# Altium schematic sheet ADTPCB.SchDoc
size C
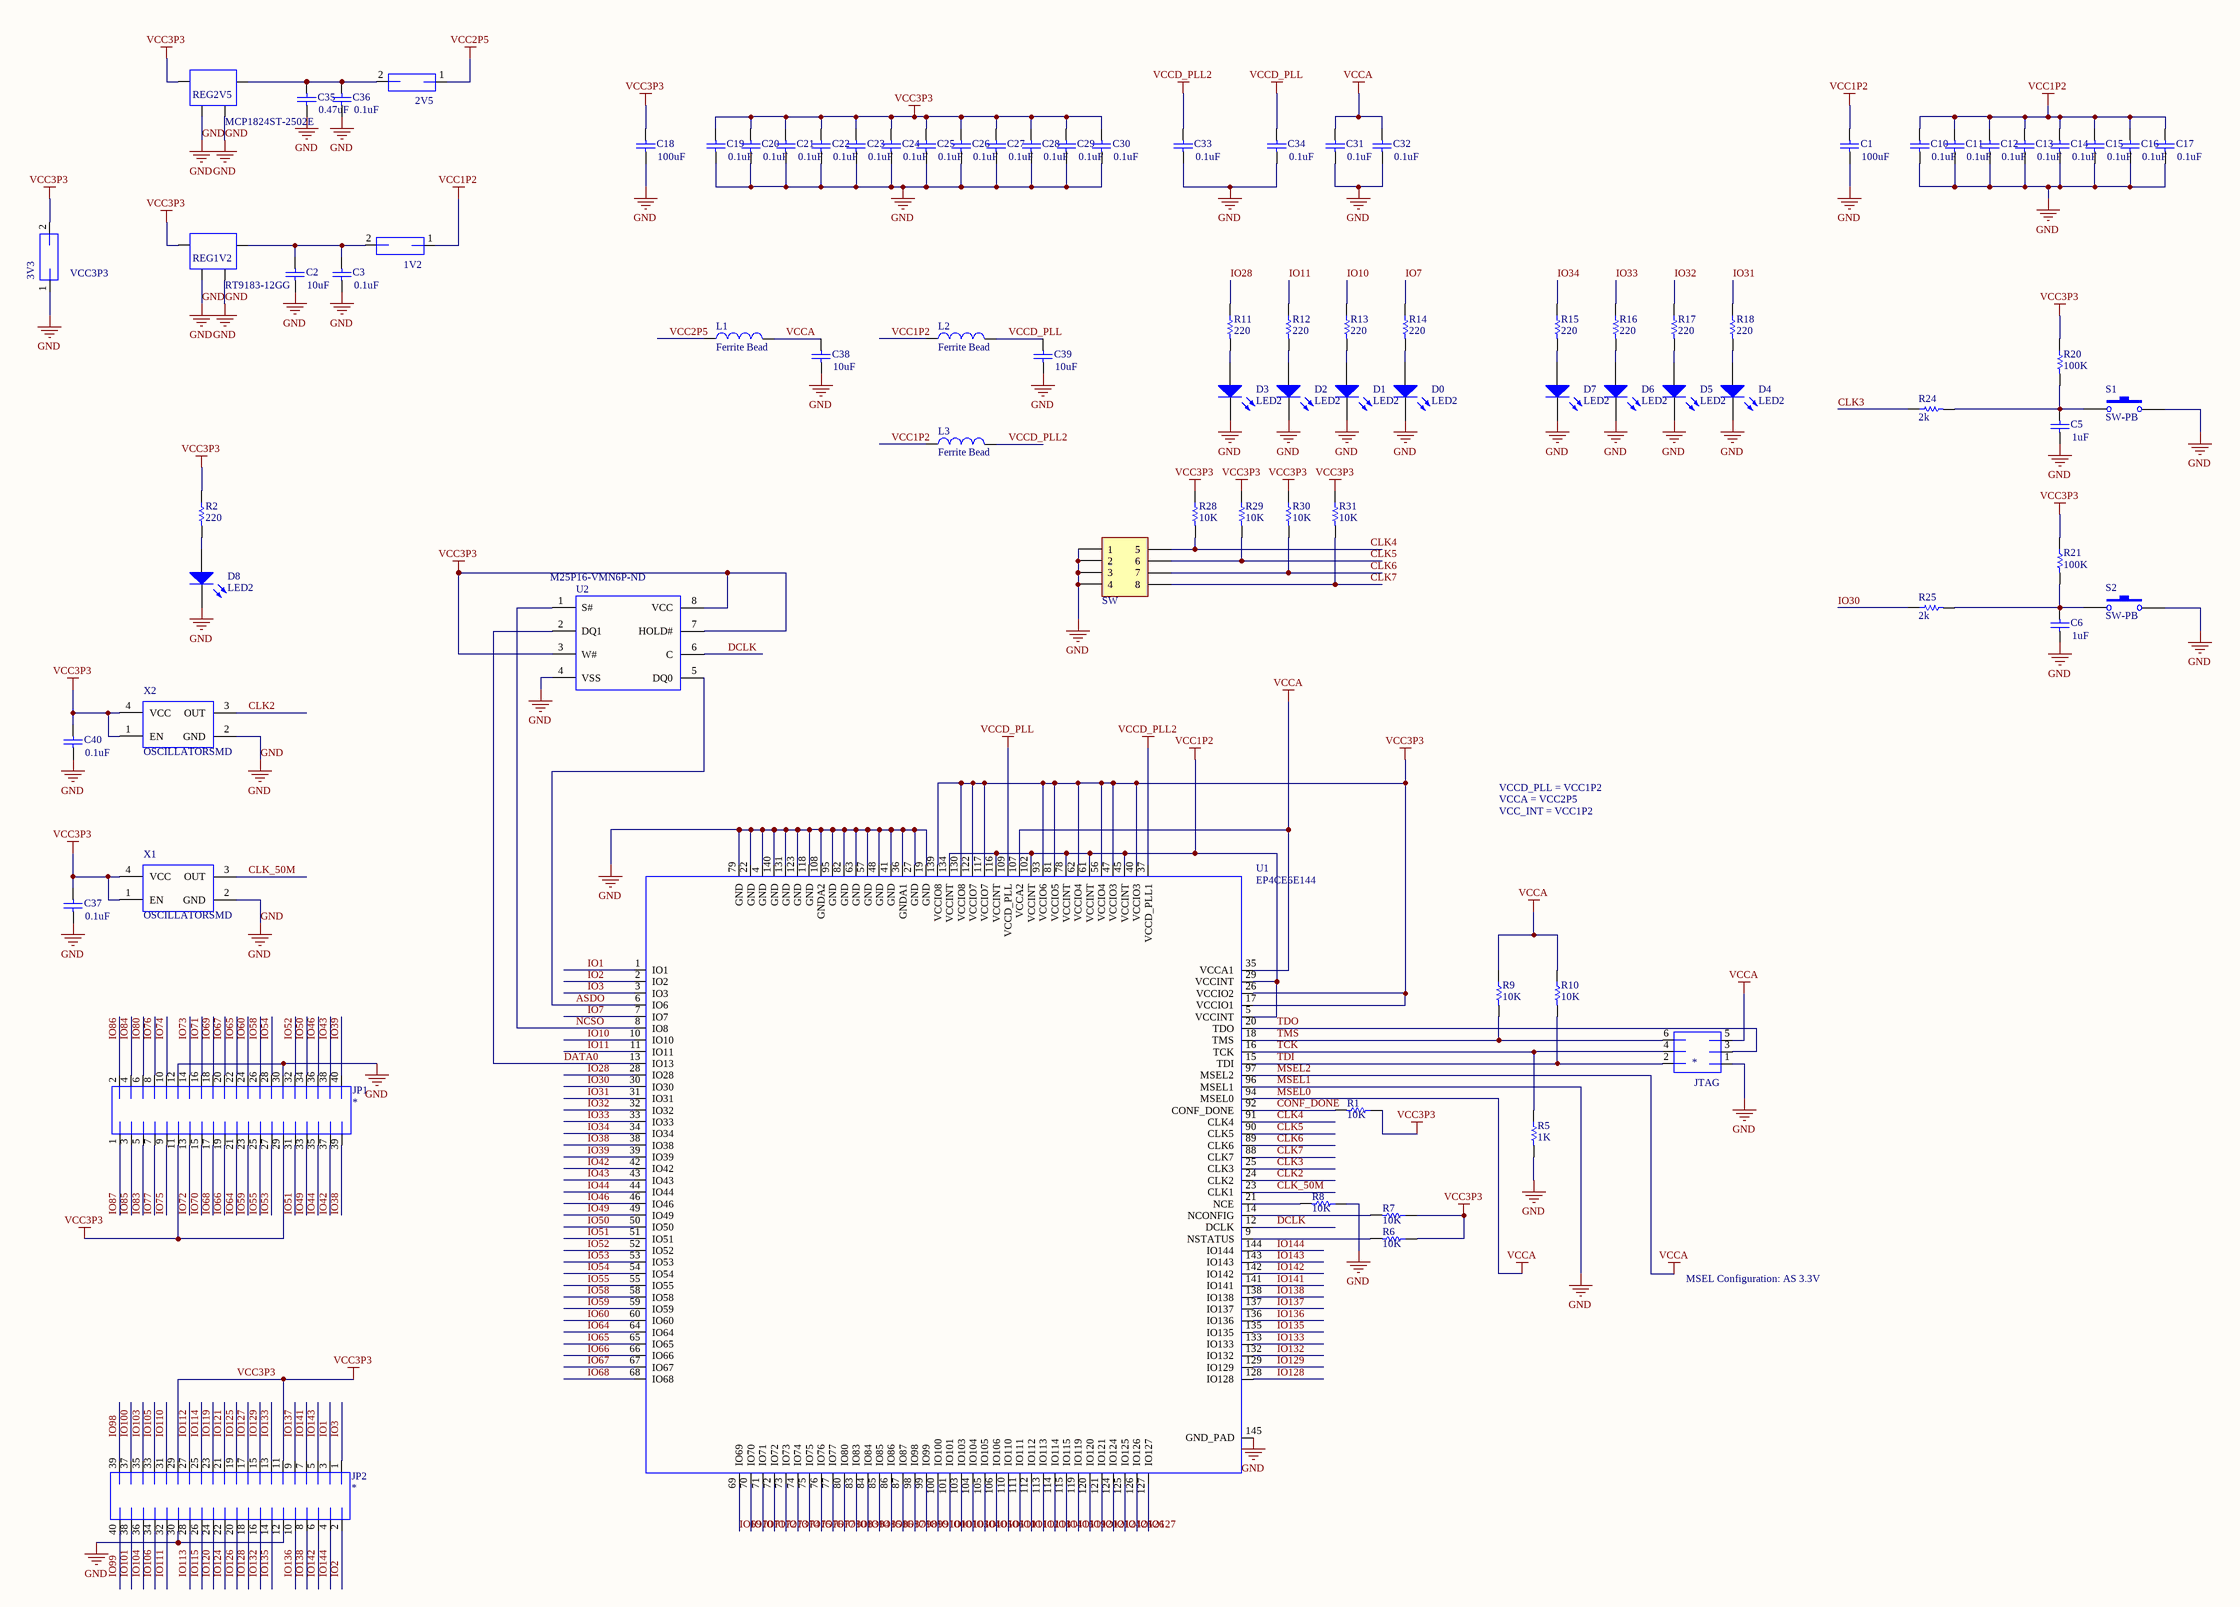
[diagram p0: ADTPCB.SchDoc]

## Parts
1V2  1V2  [HDR1X2]  (value not drawn)
2V5  2V5  [HDR1X2]  (value not drawn)
3V3  VCC3P3  [HDR1X2]
C1  value 100uF  [C1206]  (hidden comment: Cap)
C2  value 10uF  [C0805]  (hidden comment: Cap)
C3  value 0.1uF  [C0805]  (hidden comment: Cap)
C5  value 1uF  [C0805]  (hidden comment: Cap)
C6  value 1uF  [C0805]  (hidden comment: Cap)
C10  value 0.1uF  [C0805]  (hidden comment: Cap)
C11  value 0.1uF  [C0805]  (hidden comment: Cap)
C12  value 0.1uF  [C0805]  (hidden comment: Cap)
C13  value 0.1uF  [C0805]  (hidden comment: Cap)
C14  value 0.1uF  [C0805]  (hidden comment: Cap)
C15  value 0.1uF  [C0805]  (hidden comment: Cap)
C16  value 0.1uF  [C0805]  (hidden comment: Cap)
C17  value 0.1uF  [C0805]  (hidden comment: Cap)
C18  value 100uF  [C1206]  (hidden comment: Cap)
C19  value 0.1uF  [C0805]  (hidden comment: Cap)
C20  value 0.1uF  [C0805]  (hidden comment: Cap)
C21  value 0.1uF  [C0805]  (hidden comment: Cap)
C22  value 0.1uF  [C0805]  (hidden comment: Cap)
C23  value 0.1uF  [C0805]  (hidden comment: Cap)
C24  value 0.1uF  [C0805]  (hidden comment: Cap)
C25  value 0.1uF  [C0805]  (hidden comment: Cap)
C26  value 0.1uF  [C0805]  (hidden comment: Cap)
C27  value 0.1uF  [C0805]  (hidden comment: Cap)
C28  value 0.1uF  [C0805]  (hidden comment: Cap)
C29  value 0.1uF  [C0805]  (hidden comment: Cap)
C30  value 0.1uF  [C0805]  (hidden comment: Cap)
C31  value 0.1uF  [C0805]  (hidden comment: Cap)
C32  value 0.1uF  [C0805]  (hidden comment: Cap)
C33  value 0.1uF  [C0805]  (hidden comment: Cap)
C34  value 0.1uF  [C0805]  (hidden comment: Cap)
C35  value 0.47uF  [C0805]  (hidden comment: Cap)
C36  value 0.1uF  [C0805]  (hidden comment: Cap)
C37  value 0.1uF  [C0805]  (hidden comment: Cap)
C38  value 10uF  [C0805]  (hidden comment: Cap)
C39  value 10uF  [C0805]  (hidden comment: Cap)
C40  value 0.1uF  [C0805]  (hidden comment: Cap)
D0  LED2  [CD2012-0805]
D1  LED2  [CD2012-0805]
D2  LED2  [CD2012-0805]
D3  LED2  [CD2012-0805]
D4  LED2  [CD2012-0805]
D5  LED2  [CD2012-0805]
D6  LED2  [CD2012-0805]
D7  LED2  [CD2012-0805]
D8  LED2  [CD2012-0805]
JP1  *  [HDR2X20]
JP2  *  [HDR2X20]
JTAG  *  [HDR1X6]
L1  Ferrite Bead  [2029]
L2  Ferrite Bead  [2029]
L3  Ferrite Bead  [2029]
R1  value 10K  [6-0805_L]  (hidden comment: Res Semi)
R2  value 220  [6-0805_L]  (hidden comment: Res Semi)
R5  value 1K  [6-0805_L]  (hidden comment: Res Semi)
R6  value 10K  [6-0805_L]  (hidden comment: Res Semi)
R7  value 10K  [6-0805_L]  (hidden comment: Res Semi)
R8  value 10K  [6-0805_L]  (hidden comment: Res Semi)
R9  value 10K  [6-0805_L]  (hidden comment: Res Semi)
R10  value 10K  [6-0805_L]  (hidden comment: Res Semi)
R11  value 220  [6-0805_L]  (hidden comment: Res Semi)
R12  value 220  [6-0805_L]  (hidden comment: Res Semi)
R13  value 220  [6-0805_L]  (hidden comment: Res Semi)
R14  value 220  [6-0805_L]  (hidden comment: Res Semi)
R15  value 220  [6-0805_L]  (hidden comment: Res Semi)
R16  value 220  [6-0805_L]  (hidden comment: Res Semi)
R17  value 220  [6-0805_L]  (hidden comment: Res Semi)
R18  value 220  [6-0805_L]  (hidden comment: Res Semi)
R20  value 100K  [6-0805_L]  (hidden comment: Res Semi)
R21  value 100K  [6-0805_L]  (hidden comment: Res Semi)
R24  value 2k  [6-0805_L]  (hidden comment: Res Semi)
R25  value 2k  [6-0805_L]  (hidden comment: Res Semi)
R28  value 10K  [6-0805_L]  (hidden comment: Res Semi)
R29  value 10K  [6-0805_L]  (hidden comment: Res Semi)
R30  value 10K  [6-0805_L]  (hidden comment: Res Semi)
R31  value 10K  [6-0805_L]  (hidden comment: Res Semi)
REG1V2  RT9183-12GG  [SOT223_M]
REG2V5  MCP1824ST-2502E  [SOT223_M]
S1  SW-PB  [EVQ-P7C01K]
S2  SW-PB  [EVQ-P7C01K]
SW  DIP  [DIP]  (value not drawn)
U1  EP4CE6E144  [EQFP144_M]
U2  Supplier Part Number 1: M25P16-VMN6P-ND  [SO8_M]  (hidden comment: *)
X1  OSCILLATORSMD  [Oscillator SMD]
X2  OSCILLATORSMD  [Oscillator SMD]  (no BOM)

## Nets
GND: 3V3.1 C1.1 C2.1 C3.1 C5.1 C6.1 C10.1 C11.1 C12.1 C13.1 C14.1 C15.1 C16.1 C17.1 C18.1 C19.1 C20.1 C21.1 C22.1 C23.1 C24.1 C25.1 C26.1 C27.1 C28.1 C29.1 C30.1 C31.1 C32.1 C33.1 C34.1 C35.1 C36.1 C37.1 C38.1 C39.1 C40.1 D0.2(K) D1.2(K) D2.2(K) D3.2(K) D4.2(K) D5.2(K) D6.2(K) D7.2(K) D8.2(K) JP1.12 JP1.30 JP2.12 JP2.30 JTAG.1 R5.2 R8.1 REG1V2.2(GND) REG1V2.4(GND1) REG2V5.2(GND) REG2V5.4(GND1) S1.2 S2.2 SW.1 SW.2 SW.3 SW.4 U1.4(GND) U1.19(GND) U1.22(GND) U1.27(GND) U1.36(GNDA1) U1.41(GND) U1.48(GND) U1.57(GND) U1.63(GND) U1.79(GND) U1.82(GND) U1.95(GND) U1.96(MSEL1) U1.108(GNDA2) U1.118(GND) U1.123(GND) U1.131(GND) U1.140(GND) U1.145(GND_PAD) U2.4(VSS) X1.2(GND) X2.2(GND)  [also labelled MSEL1]
MSEL0: C31.2 C32.2 C38.2 JTAG.5 L1.2 R9.1 R10.1 U1.35(VCCA1) U1.94(MSEL0) U1.97(MSEL2) U1.107(VCCA2)  [also labelled MSEL2, VCCA]
VCC1P2: 1V2.1 C1.2 C10.2 C11.2 C12.2 C13.2 C14.2 C15.2 C16.2 C17.2 L2.1 L3.1 U1.5(VCCINT) U1.29(VCCINT) U1.45(VCCINT) U1.61(VCCINT) U1.78(VCCINT) U1.102(VCCINT) U1.116(VCCINT) U1.134(VCCINT)
VCC2P5: 2V5.1 L1.1
VCC3P3: 3V3.2 C18.2 C19.2 C20.2 C21.2 C22.2 C23.2 C24.2 C25.2 C26.2 C27.2 C28.2 C29.2 C30.2 C37.2 C40.2 JP1.11 JP1.29 JP2.11 JP2.29 R1.1 R2.1 R6.1 R7.1 R20.1 R21.1 R28.1 R29.1 R30.1 R31.1 REG1V2.1(IN) REG2V5.1(IN) U1.17(VCCIO1) U1.26(VCCIO2) U1.40(VCCIO3) U1.47(VCCIO3) U1.56(VCCIO4) U1.62(VCCIO4) U1.81(VCCIO5) U1.93(VCCIO6) U1.117(VCCIO7) U1.122(VCCIO7) U1.130(VCCIO8) U1.139(VCCIO8) U2.3(W#) U2.7(HOLD#) U2.8(VCC) X1.1(EN) X1.4(VCC) X2.1(EN) X2.4(VCC)
VCCD_PLL: C34.2 C39.2 L2.2 U1.109(VCCD_PLL)
VCCD_PLL2: C33.2 L3.2 U1.37(VCCD_PLL1)
ASDO: U1.6(IO6) U2.5(DQ0)
CLK2: U1.24(CLK2) X2.3(OUT)
CLK3: R24.1 U1.25(CLK3)
CLK4: R28.2 SW.5 U1.91(CLK4)
CLK5: R29.2 SW.6 U1.90(CLK5)
CLK6: R30.2 SW.7 U1.89(CLK6)
CLK7: R31.2 SW.8 U1.88(CLK7)
CLK_50M: U1.23(CLK1) X1.3(OUT)
CONF_DONE: R1.2 U1.92(CONF_DONE)
DATA0: U1.13(IO13) U2.2(DQ1)
DCLK: U1.12(DCLK) U2.6(C)
IO1: JP2.3 U1.1(IO1)
IO2: JP2.2 U1.2(IO2)
IO3: JP2.1 U1.3(IO3)
IO7: R14.1 U1.7(IO7)
IO10: R13.1 U1.10(IO10)
IO11: R12.1 U1.11(IO11)
IO28: R11.1 U1.28(IO28)
IO30: R25.1 U1.30(IO30)
IO31: R18.1 U1.31(IO31)
IO32: R17.1 U1.32(IO32)
IO33: R16.1 U1.33(IO33)
IO34: R15.1 U1.34(IO34)
IO38: JP1.39 U1.38(IO38)
IO39: JP1.40 U1.39(IO39)
IO42: JP1.37 U1.42(IO42)
IO43: JP1.38 U1.43(IO43)
IO44: JP1.35 U1.44(IO44)
IO46: JP1.36 U1.46(IO46)
IO49: JP1.33 U1.49(IO49)
IO50: JP1.34 U1.50(IO50)
IO51: JP1.31 U1.51(IO51)
IO52: JP1.32 U1.52(IO52)
IO53: JP1.27 U1.53(IO53)
IO54: JP1.28 U1.54(IO54)
IO55: JP1.25 U1.55(IO55)
IO58: JP1.26 U1.58(IO58)
IO59: JP1.23 U1.59(IO59)
IO60: JP1.24 U1.60(IO60)
IO64: JP1.21 U1.64(IO64)
IO65: JP1.22 U1.65(IO65)
IO66: JP1.19 U1.66(IO66)
IO67: JP1.20 U1.67(IO67)
IO68: JP1.17 U1.68(IO68)
IO69: JP1.18 U1.69(IO69)
IO70: JP1.15 U1.70(IO70)
IO71: JP1.16 U1.71(IO71)
IO72: JP1.13 U1.72(IO72)
IO73: JP1.14 U1.73(IO73)
IO74: JP1.10 U1.74(IO74)
IO75: JP1.9 U1.75(IO75)
IO76: JP1.8 U1.76(IO76)
IO77: JP1.7 U1.77(IO77)
IO80: JP1.6 U1.80(IO80)
IO83: JP1.5 U1.83(IO83)
IO84: JP1.4 U1.84(IO84)
IO85: JP1.3 U1.85(IO85)
IO86: JP1.2 U1.86(IO86)
IO87: JP1.1 U1.87(IO87)
IO98: JP2.39 U1.98(IO98)
IO99: JP2.40 U1.99(IO99)
IO100: JP2.37 U1.100(IO100)
IO101: JP2.38 U1.101(IO101)
IO103: JP2.35 U1.103(IO103)
IO104: JP2.36 U1.104(IO104)
IO105: JP2.33 U1.105(IO105)
IO106: JP2.34 U1.106(IO106)
IO110: JP2.31 U1.110(IO110)
IO111: JP2.32 U1.111(IO111)
IO112: JP2.27 U1.112(IO112)
IO113: JP2.28 U1.113(IO113)
IO114: JP2.25 U1.114(IO114)
IO115: JP2.26 U1.115(IO115)
IO119: JP2.23 U1.119(IO119)
IO120: JP2.24 U1.120(IO120)
IO121: JP2.21 U1.121(IO121)
IO124: JP2.22 U1.124(IO124)
IO125: JP2.19 U1.125(IO125)
IO126: JP2.20 U1.126(IO126)
IO127: JP2.17 U1.127(IO127)
IO128: JP2.18 U1.128(IO128)
IO129: JP2.15 U1.129(IO129)
IO132: JP2.16 U1.132(IO132)
IO133: JP2.13 U1.133(IO133)
IO135: JP2.14 U1.135(IO135)
IO136: JP2.10 U1.136(IO136)
IO137: JP2.9 U1.137(IO137)
IO138: JP2.8 U1.138(IO138)
IO141: JP2.7 U1.141(IO141)
IO142: JP2.6 U1.142(IO142)
IO143: JP2.5 U1.143(IO143)
IO144: JP2.4 U1.144(IO144)
NCSO: U1.8(IO8) U2.1(S#)
TCK: JTAG.4 R5.1 U1.16(TCK)
TDI: JTAG.2 R10.2 U1.15(TDI)
TDO: JTAG.3 U1.20(TDO)
TMS: JTAG.6 R9.2 U1.18(TMS)
Net1V2_2: 1V2.2 C2.2 C3.2 REG1V2.3(OUT)
Net2V5_2: 2V5.2 C35.2 C36.2 REG2V5.3(OUT)
NetC5_2: C5.2 R20.2 R24.2 S1.1
NetC6_2: C6.2 R21.2 R25.2 S2.1
NetD0_1: D0.1(A) R14.2
NetD1_1: D1.1(A) R13.2
NetD2_1: D2.1(A) R12.2
NetD3_1: D3.1(A) R11.2
NetD4_1: D4.1(A) R18.2
NetD5_1: D5.1(A) R17.2
NetD6_1: D6.1(A) R16.2
NetD7_1: D7.1(A) R15.2
NetD8_1: D8.1(A) R2.2
NetR6_2: R6.2 U1.9(NSTATUS)
NetR7_2: R7.2 U1.14(NCONFIG)
NetR8_2: R8.2 U1.21(NCE)

## Notes on the sheet
- VCCD_PLL = VCC1P2
- VCCA = VCC2P5
- VCC_INT = VCC1P2
- MSEL Configuration: AS 3.3V

## Library data of the parts
1V2 2V5 3V3 = JP1Q: CONN HEADER 36POS .100 VERT TIN; Supplier Part Number 1: WM50014-36-ND; Supplier 1: Digi-Key; Supplier Part Number 2: 538-22-28-4360; Supplier 2: Mouser
C1 C18 = Cap: CAP CER 100UF 6.3V Y5V 1206; Supplier Part Number 1: 490-4512-1-ND; Supplier 1: Digi-Key; Supplier Part Number 2: 81-GRM31CF50J107ZE1L; Supplier 2: Mouser
C2 C38 C39 = Cap: CAP CER 10UF 10V Y5V 0805; Supplier Part Number 1: 311-1355-1-ND; Supplier 1: Digi-Key; Supplier Part Number 2: 810-C2012X5R1A106K-3; Supplier 2: Mouser
C3 C10-C17 C19-C34 C36 C37 C40 = Cap: CAP CER 0.1UF 16V 10% X7R 0805; Supplier Part Number 1: 399-1167-1-ND; Supplier 1: Digi-Key; Supplier Part Number 2: 77-VJ0805V105ZXJCBC; Supplier 2: Mouser
C5 C6 = Cap: CAP CER 1UF 16V Y5V 0805; Supplier Part Number 1: 311-1457-1-ND; Supplier 1: Digi-Key; Supplier Part Number 2: 80-C0805C104K4R; Supplier 2: Mouser
C35 = Cap: CAP CER 0.47UF 16V 10% X7R 0805; Supplier Part Number 1: 587-1282-1-ND; Supplier 1: Digi-Key; Supplier Part Number 2: 963-EMK212B7474KD-T; Supplier 2: Mouser
D0-D8 = LED2: LED GREEN CLEAR THIN 0805 SMD; Supplier Part Number 1: 475-1410-1-ND; Supplier 1: Digi-Key; Supplier Part Number 2: 720-LGR971-KN-1; Supplier 2: Mouser
JP1 JP2 = JP20Q: CONN HEADER 36POS .100 VERT TIN; Supplier Part Number 1: WM50014-36-ND; Supplier 1: Digi-Key; Supplier Part Number 2: 538-22-28-4360; Supplier 2: Mouser
JTAG = JP3Q: CONN HEADER 36POS .100 VERT TIN; Supplier Part Number 1: WM50014-36-ND; Supplier 1: Digi-Key; Supplier Part Number 2: 538-22-28-4360; Supplier 2: Mouser
L1-L3 = Inductor: FERRITE CHIP BEAD 600 OHM SMD; Supplier Part Number 1: 445-2206-1-ND; Supplier 1: Digi-Key; Supplier Part Number 2: 810-MPZ2012S601A; Supplier 2: Mouser
R1 R6-R10 R28-R31 = Res Semi: RES 10K OHM 1/8W 5% 0805 SMD; Supplier Part Number 1: RMCF0805JT10K0CT-ND; Supplier 1: Digi-Key; Supplier Part Number 2: 667-ERJ-6GEYJ103V; Supplier 2: Mouser
R2 R11-R18 = Res Semi: RES 220 OHM 1/8W 5% 0805 SMD; Supplier Part Number 1: RMCF0805JT220RCT-ND; Supplier 1: Digi-Key; Supplier Part Number 2: 667-ERJ-6GEYJ221V; Supplier 2: Mouser
R5 = Res Semi: RES 1.0K OHM 1/8W 5% 0805 SMD; Supplier Part Number 1: RHM1.0KCPCT-ND; Supplier 1: Digi-Key; Supplier Part Number 2: 667-ERJ-6GEYJ102V; Supplier 2: Mouser
R20 R21 = Res Semi: RES 100K OHM 1/8W 5% 0805 SMD; Supplier Part Number 1: RMCF0805JT100KCT-ND; Supplier 1: Digi-Key; Supplier Part Number 2: 667-ERJ-6ENF1003V; Supplier 2: Mouser
R24 R25 = Res Semi: RES 2K OHM 1/8W 5% 0805 SMD; Supplier Part Number 1: RMCF0805JT2K00CT-ND; Supplier 1: Digi-Key; Supplier Part Number 2: 71-CRCW0805-2.0K-E3; Supplier 2: Mouser
REG1V2 = RT9183-12GG: IC REG LDO 1.2V 1.5A SOT223; Supplier Part Number 1: 1028-1069-1-ND; Supplier 1: Digi-Key; Supplier Part Number 2: 863-NCP566ST12T3G; Supplier 2: Mouser
REG2V5 = RT9183-12GG: IC REG LDO 2.5V .3A SOT223-3; Supplier Part Number 1: MCP1824ST-2502E/DBCT-ND; Supplier 1: Digi-Key; Supplier Part Number 2: 579-MCP1824T-2502EDC; Supplier 2: Mouser
S1 S2 = SW-PB: SWITCH TACTILE SPST-NO 0.05A 12V; Supplier Part Number 1: P12277SCT-ND; Supplier 1: Digi-Key; Supplier Part Number 2: 667-EVQ-P7J01K; Supplier 2: Mouser
SW = DIP: SWITCH DIP HALF PITCH 4POS; Supplier Part Number 1: CT2184LPST-ND; Supplier 1: Digi-Key; Supplier Part Number 2: 774-2184LPST; Supplier 2: Mouser
U1 = EP4CE6E144: IC CYCLONE IV E FPGA 144EQFP; Supplier 1: Digi-Key; Supplier Part Number 1: 544-2746-ND; Supplier Part Number 2: 989-EP4CE6E22C8N; Supplier 2: Mouser
U2 = M25P16: IC FLASH 16MBIT 75MHZ 8SOIC; Supplier 1: Digi-Key; Supplier Part Number 2: 797-25FL216K0PMFI040; Supplier 2: Mouser
X1 X2 = OSCILLATORSMD: OSCILLATOR 50.00MHZ SMD; Supplier Part Number 1: CTX1011CT-ND; Supplier 1: Digi-Key; Supplier Part Number 2: 774-636L3I050M00000; Supplier 2: Mouser